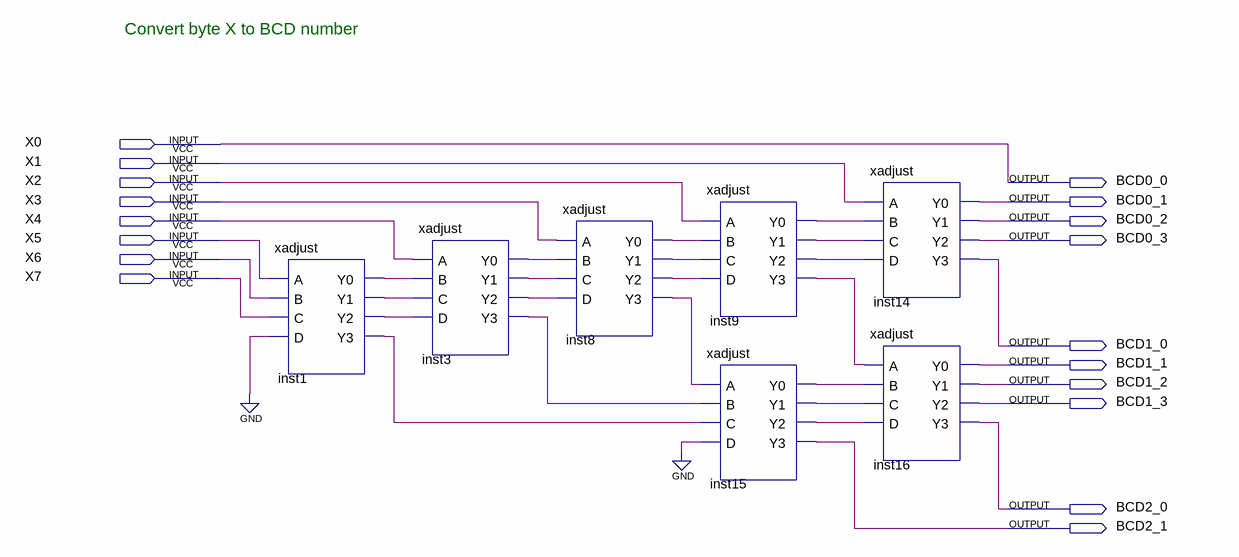
[diagram p0: schematic sheet]
// Quartus schematic convert_byte2BCD.bdf as structural Verilog: 7 symbols, 18 pins
module convert_byte2BCD (
  input  X0,
  input  X1,
  input  X2,
  input  X3,
  input  X4,
  input  X5,
  input  X6,
  input  X7,
  output BCD0_0,
  output BCD0_1,
  output BCD0_2,
  output BCD0_3,
  output BCD1_0,
  output BCD1_1,
  output BCD1_2,
  output BCD1_3,
  output BCD2_0,
  output BCD2_1
);

  wire inst1_y0, inst1_y1, inst1_y2, inst1_y3, inst3_y0, inst3_y1, inst3_y2, inst3_y3, inst8_y0, inst8_y1,
       inst8_y2, inst8_y3, inst9_y0, inst9_y1, inst9_y2, inst9_y3, inst15_y0, inst15_y1, inst15_y2;

  xadjust inst1 (.A(X5), .B(X6), .C(X7), .D(1'b0), .Y0(inst1_y0), .Y1(inst1_y1), .Y2(inst1_y2), .Y3(inst1_y3));
  xadjust inst3 (
    .A(X4), .B(inst1_y0), .C(inst1_y1), .D(inst1_y2), .Y0(inst3_y0), .Y1(inst3_y1), .Y2(inst3_y2),
    .Y3(inst3_y3));
  xadjust inst8 (
    .A(X3), .B(inst3_y0), .C(inst3_y1), .D(inst3_y2), .Y0(inst8_y0), .Y1(inst8_y1), .Y2(inst8_y2),
    .Y3(inst8_y3));
  xadjust inst9 (
    .A(X2), .B(inst8_y0), .C(inst8_y1), .D(inst8_y2), .Y0(inst9_y0), .Y1(inst9_y1), .Y2(inst9_y2),
    .Y3(inst9_y3));
  xadjust inst15 (
    .A(inst8_y3), .B(inst3_y3), .C(inst1_y3), .D(1'b0), .Y0(inst15_y0), .Y1(inst15_y1), .Y2(inst15_y2),
    .Y3(BCD2_1));
  xadjust inst14 (.A(X1), .B(inst9_y0), .C(inst9_y1), .D(inst9_y2), .Y0(BCD0_1), .Y1(BCD0_2), .Y2(BCD0_3), .Y3(BCD1_0));
  xadjust inst16 (
    .A(inst9_y3), .B(inst15_y0), .C(inst15_y1), .D(inst15_y2), .Y0(BCD1_1), .Y1(BCD1_2), .Y2(BCD1_3),
    .Y3(BCD2_0));

  assign BCD0_0 = X0;

  // Notes on the sheet:
  //   Convert byte X to BCD number
endmodule
